# EAGLE schematic charger (EAGLE 9.6.1)
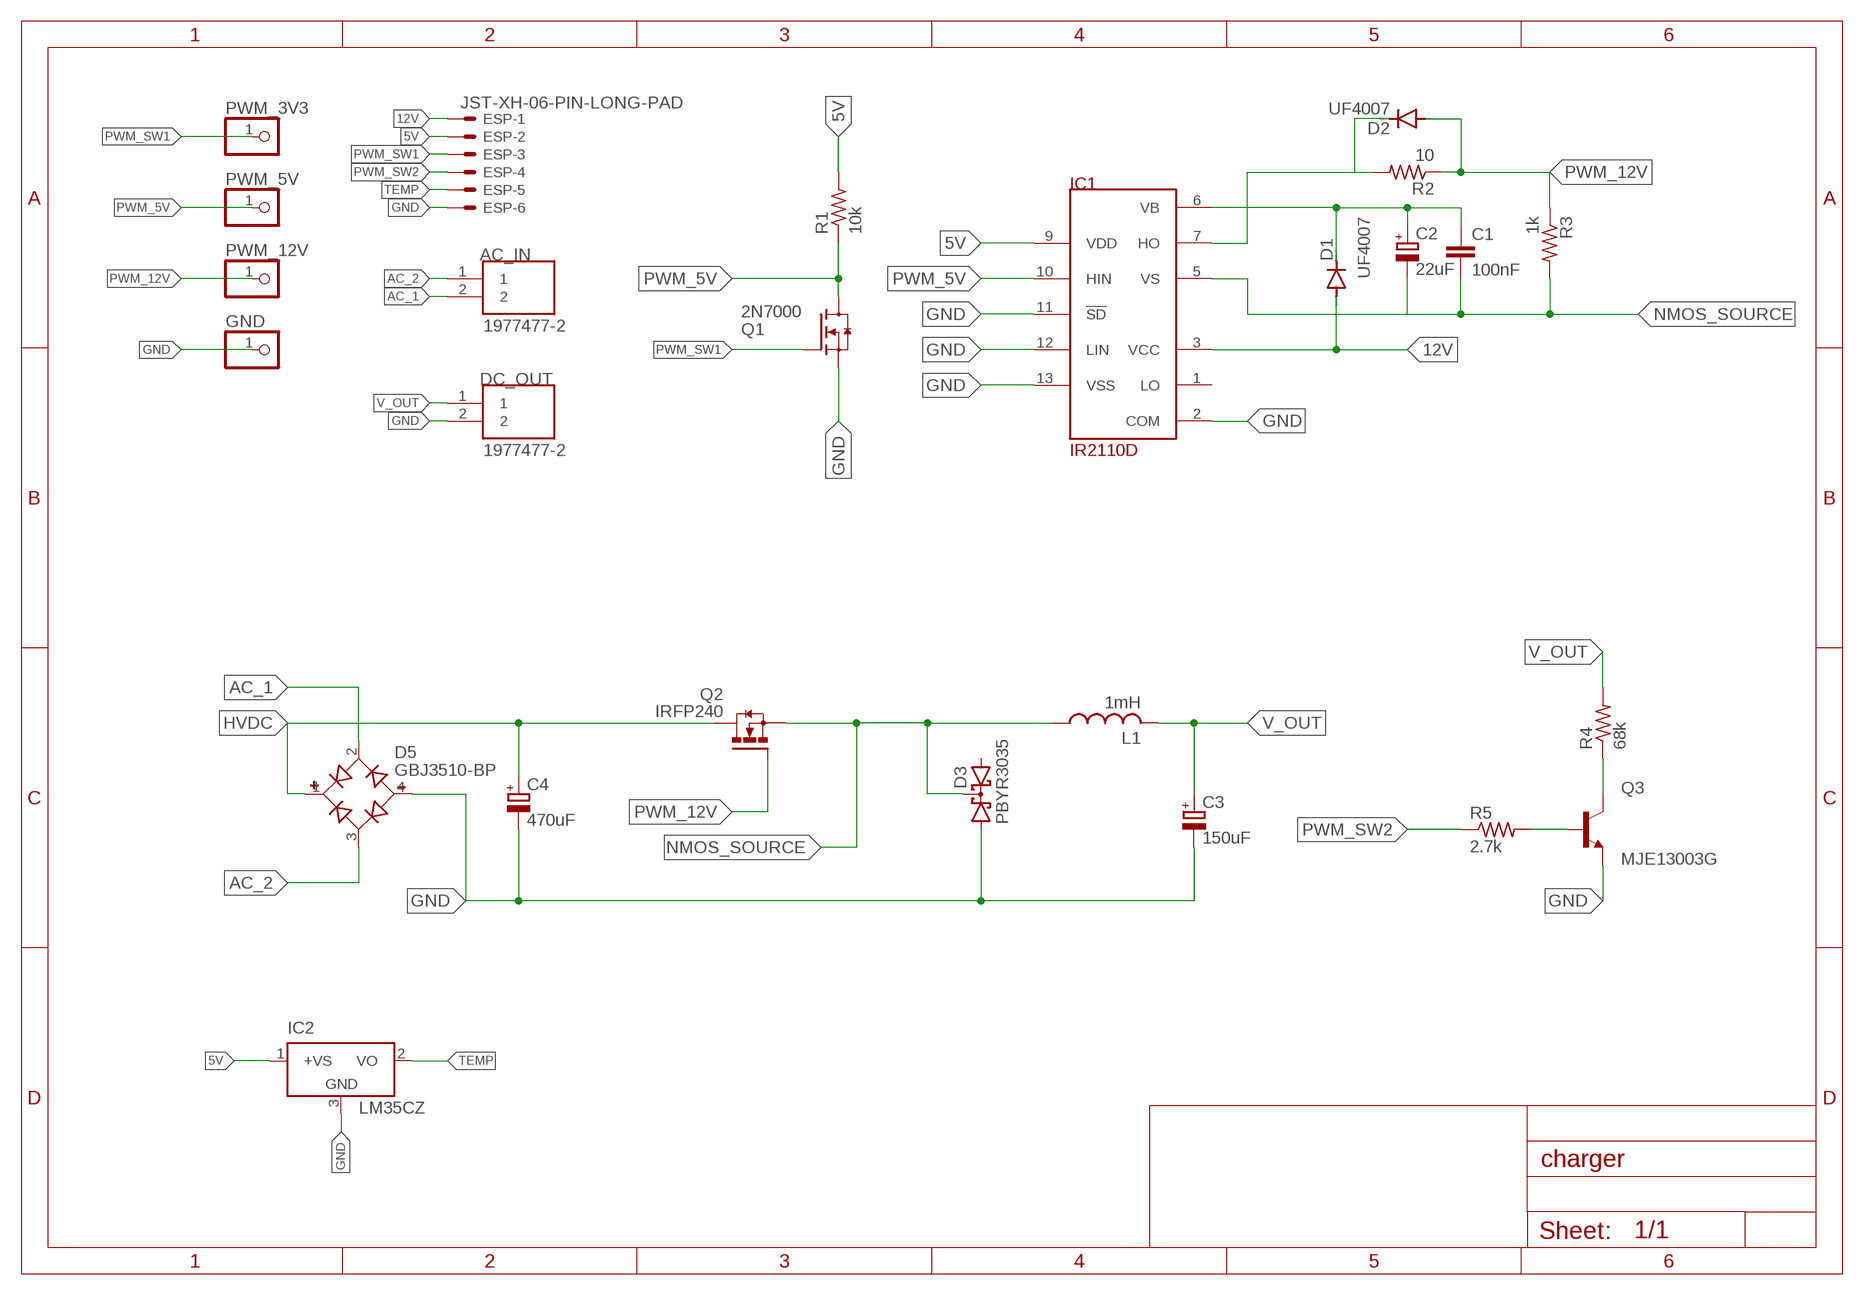
[diagram p0: schematic, sheet 1]

## Parts
AC_IN  1977477-2  [TE_1977477-2]
C1  100nF  C-EU025-025X050  [C025-025X050]
C2  22uF  CPOL-EUE2,5-6E  [E2,5-6E]
C3  150uF  CPOL-EUE7.5-18  [E7,5-18]
C4  470uF  CPOL-EUE10-35  [EB35D]
D1  UF4007  BAS15  [DO34-7]
D2  UF4007  BAS15  [DO34-7]
D3  PBYR3035  [SOT93S]
D5  GBJ3510-BP  [DIOB_GBJ3510-BP]
DC_OUT  1977477-2  [TE_1977477-2]
ESP  JST-XH-06-PIN-LONG-PAD  [JST-XH-06-PACKAGE-LONG-PAD]
GND  PINHD-1X1  [1X01]
IC1  IR2110D  [DIL14]
IC2  LM35CZ  [TO92]
L1  1mH  L-USTJ7-U1  [TJ7-U1]
PWM_3V3  PINHD-1X1  [1X01]
PWM_5V  PINHD-1X1  [1X01]
PWM_12V  PINHD-1X1  [1X01]
Q1  2N7000  [TO92]
Q2  IRFP240  [TO247AC]
Q3  MJE13003G  [TO229P780X300X1364-3]
R1  10k  R-US_0204/7  [0204/7]
R2  10  R-US_0204/7  [0204/7]
R3  1k  R-US_0204/7  [0204/7]
R4  68k  R-US_0204/7  [0204/7]
R5  2.7k  R-US_0204/7  [0204/7]

## Nets
5V: ESP.2 IC1.9(VDD) IC2.1(+VS) R1.2
12V: D1.A ESP.1 IC1.3(VCC)
AC_1: AC_IN.2 D5.2(AC1)
AC_2: AC_IN.1 D5.3(AC2)
GND: C3.- C4.- D3.A1 D5.4(-) DC_OUT.2 ESP.6 GND.1 IC1.2(COM) IC1.11(!SD) IC1.12(LIN) IC1.13(VSS) IC2.3(GND) Q1.1(S) Q3.3(E)
HVDC: C4.+ D5.1(+) Q2.2(D)
N$2: D2.C IC1.7(HO) R2.2
N$3: Q3.2(C) R4.1
N$5: Q3.1(B) R5.2
NMOS_SOURCE: C1.2 C2.- D3.C IC1.5(VS) L1.1 Q2.3(S) R3.2
PWM_5V: IC1.10(HIN) PWM_5V.1 Q1.3(D) R1.1
PWM_12V: D2.A PWM_12V.1 Q2.1(G) R2.1 R3.1
PWM_SW1: ESP.3 PWM_3V3.1 Q1.2(G)
PWM_SW2: ESP.4 R5.1
TEMP: ESP.5 IC2.2(VO)
V_OUT: C3.+ DC_OUT.1 L1.2 R4.2
VB: C1.1 C2.+ D1.C IC1.6(VB)
Unconnected: D3.A2 IC1.1(LO)

## Library data of the parts
AC_IN DC_OUT = terminal_block_TA:1977477-2: Check availability <https://pricing.snapeda.com/parts/1977477-2/TE%20Connectivity/view-part?ref=eda>; AVAILABILITY: In Stock; COMMENT: 1977477-2; DESCRIPTION: Conn Barrier Strip 2 POS 8.25mm Solder ST Thru-Hole 15A/Contact Carton; MF: TE Connectivity; MP: 1977477-2; PACKAGE: None; PRICE: None; PURCHASE-URL: https://pricing.snapeda.com/search/part/1977477-2/?ref=eda
C1 = rcl:C-EU: CAPACITOR, European symbol; SPICEPREFIX: C
C2-C4 = rcl:CPOL-EU: POLARIZED CAPACITOR, European symbol; SPICEPREFIX: C
D1 D2 = diode:BAS15: DIODE high speed
D3 = diode:PBYR3035: Dual DIODE common cathode
D5 = GBJ3510-BP:GBJ3510-BP: Diode Rectifier Bridge Single 1KV 35A 4-Pin(4+Tab) Case GBJ Bulk/Tube Check availability <https://pricing.snapeda.com/parts/GBJ3510-BP/Micro%20Commercial/view-part?ref=eda>; AVAILABILITY: In Stock; DESCRIPTION: Bridge Rectifier Single Phase Standard 1 kV Through Hole GBJ; MF: Micro Commercial; MP: GBJ3510-BP; PACKAGE: SIP-4 Micro Commercial Co; PRICE: None; PURCHASE-URL: https://pricing.snapeda.com/search/part/GBJ3510-BP/?ref=eda
ESP = Rembrandt Electronics - JST XH Connectors v1-0:JST-XH-06-PIN: JST XH Connector 2 Pin Wire to board connector. Pitch: 2,54 mm, (0.100") Number of pins: 6 Created by Rembrandt Electronics www.rembrandtelectronics.com
GND PWM_3V3 PWM_5V PWM_12V = pinhead:PINHD-1X1: PIN HEADER
IC1 = irs:IR2110
IC2 = lm35:LM35: Single-Supply Centigrade Temperature Sensor Vout = (10mV/°C x Temp °C) +5mmmV Source: http://www.national.com/ds/LM/LM35.pdf
L1 = custom_inductor:L-US: INDUCTOR, American symbol; SPICEPREFIX: L
Q1 = 2N7000:2N7000: Check prices <https://pricing.snapeda.com/parts/2N7000/STMicroelectronics/view-part?ref=eda>; AVAILABILITY: In Stock; DESCRIPTION: N-Channel 60V 350mA (Tc) 1W (Tc) Through Hole TO-92-3; MF: STMicroelectronics; MP: 2N7000; PACKAGE: E-PKG AXIAL-LEADED-2 ON Semiconductor; PRICE: None
Q2 = IRFP240(TO-247):IRFP240: MOSFET N-CH 200V 20A TO-247AC Check availability <https://pricing.snapeda.com/parts/IRFP240/Vishay%20Siliconix/view-part?ref=eda>; AVAILABILITY: In Stock; DESCRIPTION: N-Channel 200 V 20A (Tc) 150W (Tc) Through Hole TO-247AC; MF: Vishay Siliconix; MP: IRFP240; PACKAGE: TO-247 Vishay Siliconix; PRICE: None
Q3 = MJE13003G:MJE13003G: Bipolar (BJT) Transistor NPN 400V 1.5A 10MHz 1.4W Through Hole TO-225AA Check availability <https://pricing.snapeda.com/parts/MJE13003G/ON%20Semiconductor/view-part?ref=eda>; AVAILABILITY: Not in stock; DESCRIPTION: Bipolar (BJT) Transistor NPN 400 V 1.5 A 10MHz 1.4 W Through Hole TO-126; MF: ON Semiconductor; MP: MJE13003G; PACKAGE: TO-126 ON Semiconductor; PRICE: None
R1-R5 = rcl:R-US_: RESISTOR, American symbol; SPICEPREFIX: R